# EAGLE design Qwiic_Haptic_Driver_DA7280 (EAGLE 9.6.2)
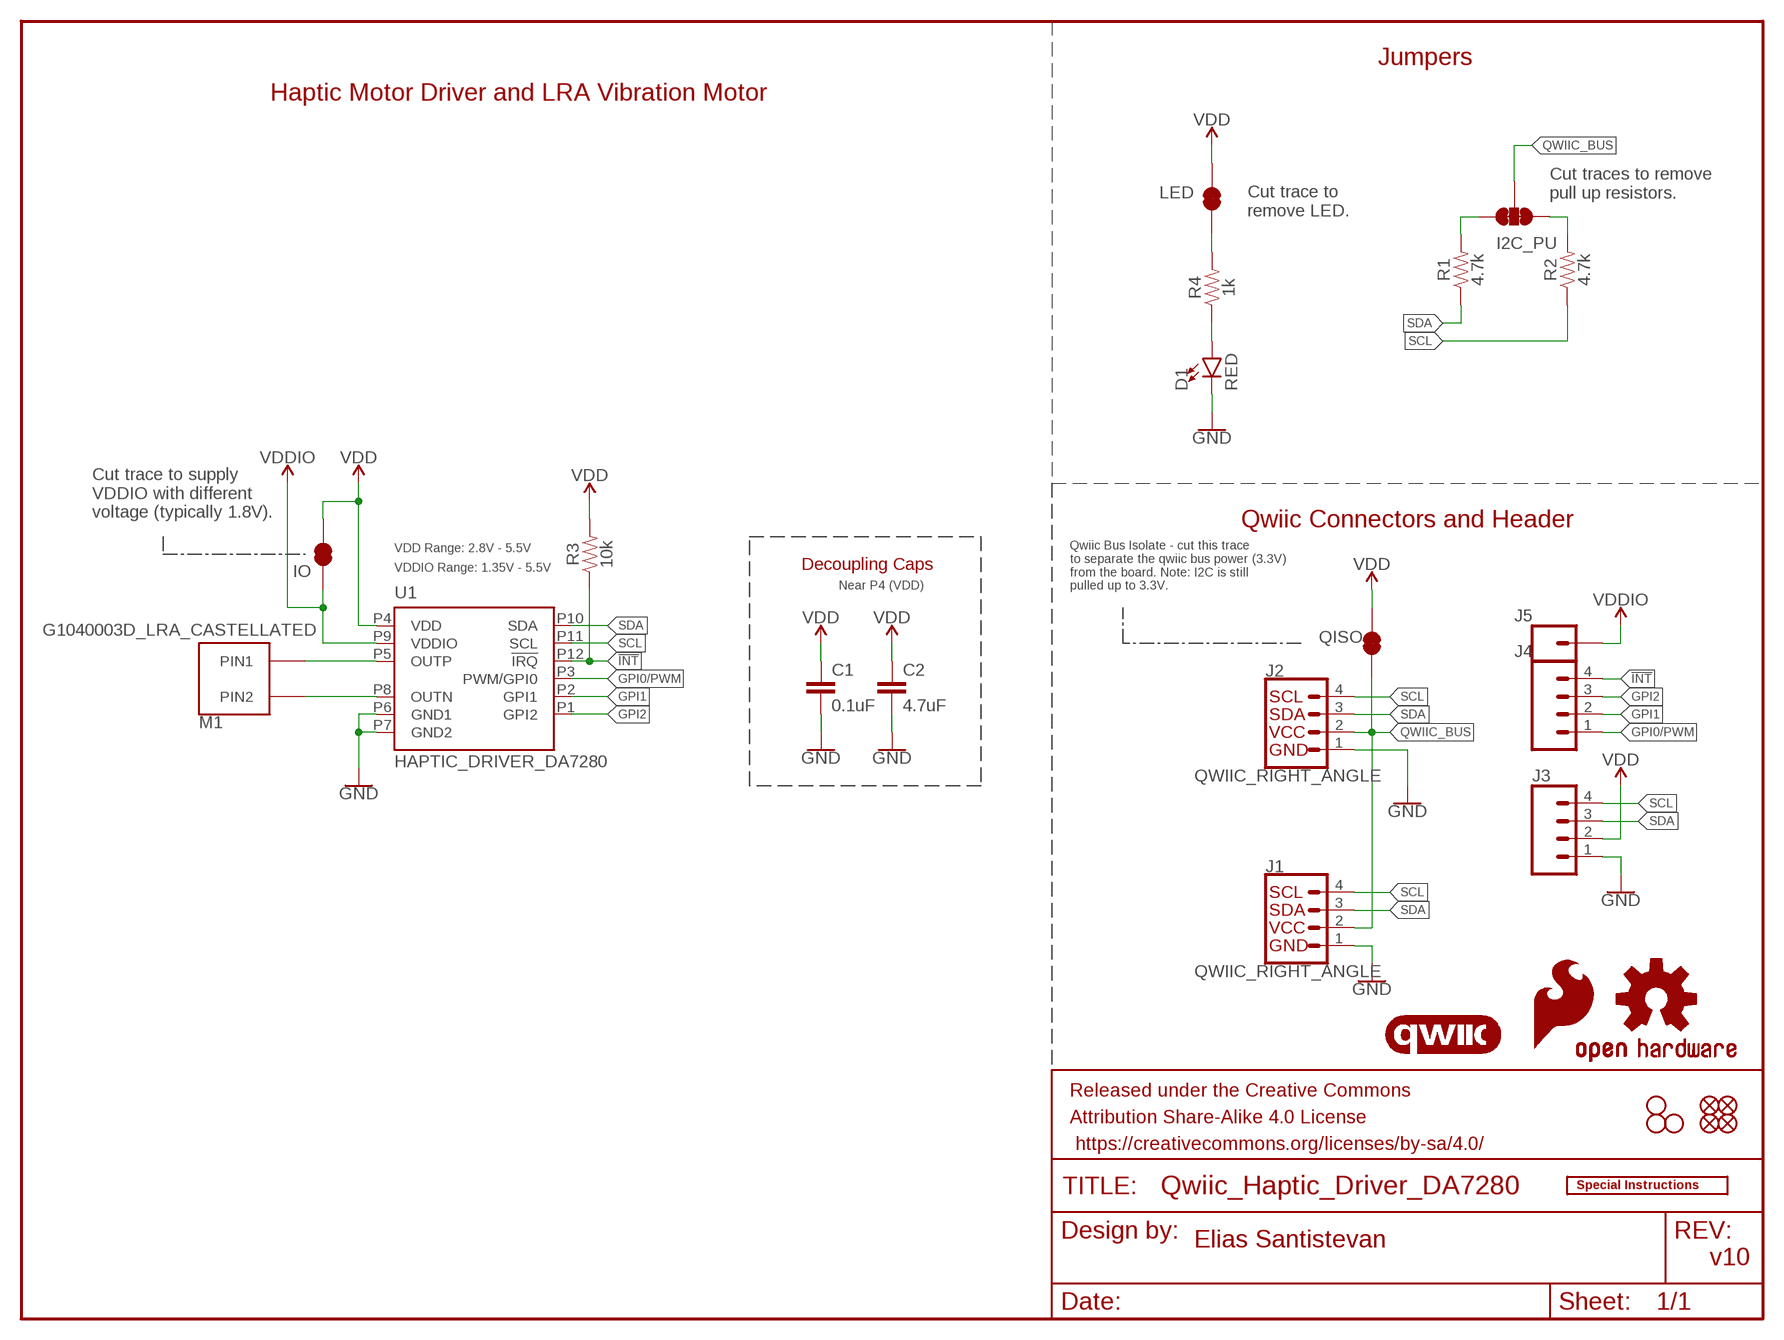
[diagram p0: schematic, sheet 1]

## Parts
C1  0.1uF  0.1UF-0603-25V-5%  [0603]
C2  4.7uF  4.7UF-0603-6.3V-(10%)  [0603]
D1  RED  LED-RED0603  [LED-0603]
FD1  FIDUCIALUFIDUCIAL  [FIDUCIAL-MICRO]
FD2  FIDUCIALUFIDUCIAL  [FIDUCIAL-MICRO]
FD3  FIDUCIALUFIDUCIAL  [FIDUCIAL-MICRO]
FD4  FIDUCIALUFIDUCIAL  [FIDUCIAL-MICRO]
FRAME1  FRAME-LETTER  [CREATIVE_COMMONS]
H1  STAND-OFFTIGHT  [STAND-OFF-TIGHT]
H2  STAND-OFFTIGHT  [STAND-OFF-TIGHT]
H4  STAND-OFFTIGHT  [STAND-OFF-TIGHT]
J1  QWIIC_RIGHT_ANGLE  QWIIC_CONNECTORJS-1MM  [JST04_1MM_RA]
J2  QWIIC_RIGHT_ANGLE  QWIIC_CONNECTORJS-1MM  [JST04_1MM_RA]
J3  CONN_041X04_NO_SILK_NO_POP  [1X04_NO_SILK]
J4  CONN_041X04_NO_SILK_NO_POP  [1X04_NO_SILK]
J5  CONN_01PTH_NO_SILK_YES_STOP  [1X01_NO_SILK]
JP1  LED  JUMPER-SMT_2_NC_TRACE_SILK  [SMT-JUMPER_2_NC_TRACE_SILK]
JP2  LED  JUMPER-SMT_2_NC_TRACE_SILK  [SMT-JUMPER_2_NC_TRACE_SILK]
JP3  I2C_PU  JUMPER-SMT_3_2-NC_TRACE_SILK  [SMT-JUMPER_3_2-NC_TRACE_SILK]
JP4  LED  JUMPER-SMT_2_NC_TRACE_SILK  [SMT-JUMPER_2_NC_TRACE_SILK]
LOGO1  SPECIAL_INSTRUCTIONS-ORDERING  [ORDERING_INSTRUCTIONS]
LOGO2  OSHW-LOGOS  [OSHW-LOGO-S]
LOGO4  SFE_LOGO_FLAME.1_INCH  [SFE_LOGO_FLAME_.1]
M1  G1040003D_LRA_CASTELLATED  [COIN_VIBRATION_MOTOR_CASTEL]
R1  4.7k  4.7KOHM-0603-1/10W-1%  [0603]
R2  4.7k  4.7KOHM-0603-1/10W-1%  [0603]
R3  10k  10KOHM-0603-1/10W-1%  [0603]
R4  1k  1KOHM-0603-1/10W-1%  [0603]
U1  HAPTIC_DRIVER_DA7280  [QFN_DA7280]
U$1  QWIIC_LOGO_3MM  [QWIIC_3MM]

## Nets
!INT!: J4.4 R3.1 U1.P12(!IRQ!)
GND: C1.2 C2.2 D1.C J1.1 J2.1 J3.1 U1.P6(GND1) U1.P7(GND2)
GPI0/PWM: J4.1 U1.P3(PWM/GPI0)
GPI1: J4.2 U1.P2(GPI1)
GPI2: J4.3 U1.P1(GPI2)
N$1: D1.A R4.1
N$2: JP1.1 R4.2
N$3: JP3.3 R1.2
N$4: JP3.1 R2.2
N$5: M1.P$1(PIN1) U1.P5(OUTP)
N$6: M1.P$2(PIN2) U1.P8(OUTN)
QWIIC_BUS: J1.2 J2.2 JP3.2 JP4.1
SCL: J1.4 J2.4 J3.4 R2.1 U1.P11(SCL)
SDA: J1.3 J2.3 J3.3 R1.1 U1.P10(SDA)
VDD: C1.1 C2.1 J3.2 JP1.2 JP2.2 JP4.2 R3.2 U1.P4(VDD)
VDDIO: J5.1 JP2.1 U1.P9(VDDIO)

## Notes on the sheet
- Jumpers
- Haptic Motor Driver and LRA Vibration Motor
- Cut traces to remove 
  pull up resistors.
- Cut trace to 
  remove LED.
- Qwiic Connectors and Header
- Cut trace to supply 
  VDDIO with different 
  voltage (typically 1.8V).
- VDD Range: 2.8V - 5.5V
- VDDIO Range: 1.35V - 5.5V | Decoupling Caps
- IO
- Near P4 (VDD)
- Qwiic Bus Isolate - cut this trace
  to separate the qwiic bus power (3.3V)
  from the board. Note: I2C is still
  pulled up to 3.3V.
- QISO
- Elias Santistevan
- v10

## Library data of the parts
C1 = SparkFun-Capacitors:0.1UF: 0.1µF ceramic capacitors A capacitor is a passive two-terminal electrical component used to store electrical energy temporarily in an electric field.; PROD_ID: CAP-08604
C2 = SparkFun-Capacitors:4.7UF: 4.7µF ceramic capacitors A capacitor is a passive two-terminal electrical component used to store electrical energy temporarily in an electric field.; PROD_ID: CAP-08280
D1 = SparkFun-LED:LED-RED: Red SMD LED Used in manufacturing of most products at SparkFun Packages: 0603 - SMD 0603 package [Product Link] <http://docs.avagotech.com/docs/AV02-0551EN> 0603 SMART - SMD 0603 SMART package ( more efficient and expensive)[Product Link] <http://www.osram-os.com/Graphics/XPic2/00077099_0.pdf> 1206 - SMD1206 package [Product Link] <https://www.sparkfun.com/datasheets/DevTools/LilyPad/Q150OVS4.pdff> SparkFun Products: Pro Mini 328 -5V <https://www.sparkfun.com/products/821> RedBoard <https://www.sparkfun.com/products/12757> IOIO-OTG <https://www.sparkfun.com/products/13613>; PROD_ID: DIO-00819
FD1-FD4 = SparkFun-Aesthetics:FIDUCIAL: Fiducial Alignment Points Point-of-reference for pick-and-place machines and other optical instruments.
FRAME1 = SparkFun-Aesthetics:FRAME-LETTER: Schematic Frame - Letter Standard 8.5x11 US Letter frame
H1 H2 H4 = SparkFun-Hardware:STAND-OFF: Stand Off Drill holes for mechanically mounting via screws, standoffs, etc. Note: Use the keepout ring to avoid running the screw head into surrounding components. Variant Overviews STAND-OFF - Mechanical footprint for a #4 phillips button head screw. STAND-OFF-TIGHT - Mechanical footprint for a #4 phillips button head screw, Example SparkFun Products Screw - Phillips Head (1/4", 4-40, 10 pack) <https://www.sparkfun.com/products/10453> (PRT-10453) Screw - Phillips Head (1/2", 4-40, 10 pack) <https://www.sparkfun.com/products/10452> (PRT-10452) Screw - Phillips Head (3/4", 4-40, 10 pack) <https://www.sparkfun.com/products/10451> (PRT-10451) Screw - Phillips Head (1", 4-40, 10 pack) <https://www.sparkfun.com/products/10450> (PRT-10450)
J1 J2 = SparkFun-Connectors:QWIIC_CONNECTOR: SparkFun I2C Standard Qwiic Connector An SMD 1mm pitch JST connector makes it easy and quick (get it? Qwiic?) to connect I2C devices to each other. The Qwiic system <http://www.sparkfun.com/qwiic> enables fast and solderless connection between popular platforms and various sensors and actuators. We carry 200mm <https://www.sparkfun.com/products/14204>, 100mm <https://www.sparkfun.com/products/14205>, 50mm <https://www.sparkfun.com/products/14206>, and breadboard friendly <https://www.sparkfun.com/products/14207> Qwiic cables. We also offer 10 pcs strips <https://www.sparkfun.com/products/14323> the SMD connectors.; PROD_ID: CONN-13694
J3 J4 = SparkFun-Connectors:CONN_04: Multi connection point. Often used as Generic Header-pin footprint for 0.1 inch spaced/style header connections On any of the 0.1 inch spaced packages, you can populate with these: Break Away Headers - Straight <https://www.sparkfun.com/products/116> (PRT-00116) Break Away Male Headers - Right Angle <https://www.sparkfun.com/products/553> (PRT-00553) Female Headers <https://www.sparkfun.com/products/115> (PRT-00115) Break Away Headers - Machine Pin <https://www.sparkfun.com/products/117> (PRT-00117) Break Away Female Headers - Swiss Machine Pin <https://www.sparkfun.com/products/743> (PRT-00743) For SCREWTERMINALS and SPRING TERMINALS visit here: Screw Terimnals on SparkFun.com <https://www.sparkfun.com/search/results?term=Screw+Terminals> (5mm/3.5mm/2.54mm spacing) This device is also useful as a general connection point to wire up your design to another part of your project. Our various solder wires solder well into these plated through hole pads. Hook-Up Wire - Assortment (Stranded, 22 AWG) <https://www.sparkfun.com/products/11375> (PRT-11375) Hook-Up Wire - Assortment (Solid Core, 22 AWG) <https://www.sparkfun.com/products/11367> (PRT-11367) View the entire wire category on our website here <https://www.sparkfun.com/categories/141> Special notes: Molex polarized connector foot print use with SKU : PRT-08231 with associated crimp pins and housings. 1MM SMD Version SKU: PRT-10208
J5 = SparkFun-Connectors:CONN_01: Single connection point. Often used as Generic Header-pin footprint for 0.1 inch spaced/style header connections On any of the 0.1 inch spaced packages, you can populate with these: Break Away Headers - Straight <https://www.sparkfun.com/products/116> (PRT-00116) Break Away Male Headers - Right Angle <https://www.sparkfun.com/products/553> (PRT-00553) Female Headers <https://www.sparkfun.com/products/115> (PRT-00115) Break Away Headers - Machine Pin <https://www.sparkfun.com/products/117> (PRT-00117) Break Away Female Headers - Swiss Machine Pin <https://www.sparkfun.com/products/743> (PRT-00743) This device is also useful as a general connection point to wire up your design to another part of your project. Our various solder wires solder well into these plated through hole pads. Hook-Up Wire - Assortment (Stranded, 22 AWG) <https://www.sparkfun.com/products/11375> (PRT-11375) Hook-Up Wire - Assortment (Solid Core, 22 AWG) <https://www.sparkfun.com/products/11367> (PRT-11367) View the entire wire category on our website here <https://www.sparkfun.com/categories/141> Special notes: SMTSO-256-ET is a "flush mount" nut for a 4-40 screw. We mostly use this on specialty testbeds; it is a nice way to connect hardware to your PCB at an adjustable hieght. Also note, the SNAP packages are for using a snappable style connector. We sell a baggie of snaps and they are also used on two LilyPad designs: Snap Assortment - 30 pack (male and female) <https://www.sparkfun.com/products/11347> (DEV-11347) LilyPad Arduino SimpleSnap <https://www.sparkfun.com/products/10941> (DEV-10941) LilyPad SimpleSnap Protoboard <https://www.sparkfun.com/products/10940> (DEV-10940)
JP1 JP2 JP4 = SparkFun-Jumpers:JUMPER-SMT_2_NC_TRACE: Normally closed trace jumper This jumper has a trace between two pads so it's normally closed (NC). Use a razor knife to open the connection. For best results follow the IPC guidelines for cutting traces: Cutout at least 0.063 mm (0.005 in). Remove all loose material to clean up the cut area. Seal the cut with an approved epoxy. Reapply solder to reclose the connection.
JP3 = SparkFun-Jumpers:JUMPER-SMT_3_2-NC_TRACE: Normally closed trace jumper (2 of 2 connections) This jumper has a trace between all three pads so they are normally closed (NC). Use a razor knife to open the connection(s). For best results follow the IPC guidelines for cutting traces: Cutout at least 0.063 mm (0.005 in). Remove all loose material to clean up the cut area. Seal the cut with an approved epoxy. Reapply solder to reclose the connection(s).
LOGO1 = SparkFun-Aesthetics:SPECIAL_INSTRUCTIONS: Special Ordering/Production Instructions Alert Symbol for special PCB ordering instructions or unique production process warnings. Ordering Instructions Production Instructions Types of information that should be added to box: Copper weight Soldermask color Silk color PCB thickness Number of layers PCB Standard: 1.6mm FR4 1 oz copper immersion silver plating red soldermask white silkscreen Types of information that should be added to box: Special wash requirements Depaneling instructions Humidification Glue curing Default text settings: 0.07 inch 9% ratio 50% line distance
LOGO2 = SparkFun-Aesthetics:OSHW-LOGO: Open-Source Hardware (OSHW) Logo This logo indicates the piece of hardware it is found on incorporates a OSHW license and/or adheres to the definition of open source hardware found here: http://freedomdefined.org/OSHW
LOGO4 = SparkFun-Aesthetics:SFE_LOGO_FLAME: SparkFun Flame Logo This is the SparkFun flame logo. The logo on the schematic will always be the same size; the package variant is the height of the flame. Default layer for the logo on the board is tSilk.
M1 = TEMP:G1040003D_LRA: G1040003D Coin Vibration Motor - Jinlong Machinery and Electronics Inc. LRA Coin Vibration Motor SparkFun Products: [PRODUCT 1] <[PRODUCT1LINK]>; PROD_ID: COMP-15536
R1 R2 = SparkFun-Resistors:4.7KOHM: 4.7kΩ resistor A resistor is a passive two-terminal electrical component that implements electrical resistance as a circuit element. Resistors act to reduce current flow, and, at the same time, act to lower voltage levels within circuits. - Wikipedia; PROD_ID: RES-07857
R3 = SparkFun-Resistors:10KOHM: 10kΩ resistor A resistor is a passive two-terminal electrical component that implements electrical resistance as a circuit element. Resistors act to reduce current flow, and, at the same time, act to lower voltage levels within circuits. - Wikipedia; PROD_ID: RES-00824
R4 = SparkFun-Resistors:1KOHM: 1kΩ resistor A resistor is a passive two-terminal electrical component that implements electrical resistance as a circuit element. Resistors act to reduce current flow, and, at the same time, act to lower voltage levels within circuits. - Wikipedia; PROD_ID: RES-07856
U1 = TEMP:HAPTIC_DRIVER_DA7280: DA7280 Haptic Driver DA7280 is a linear resonant actuator (LRA) and eccentric rotating mass (ERM) haptic driver offering automatic closed-loop LRA resonant frequency tracking.; PROD_ID: IC-15534
U$1 = SparkFun-Aesthetics:QWIIC_LOGO: Qwiic Logos for placement on schematic and PCB. The 5.5mm silk logo is best for placing next to Qwiic connector.

## Board
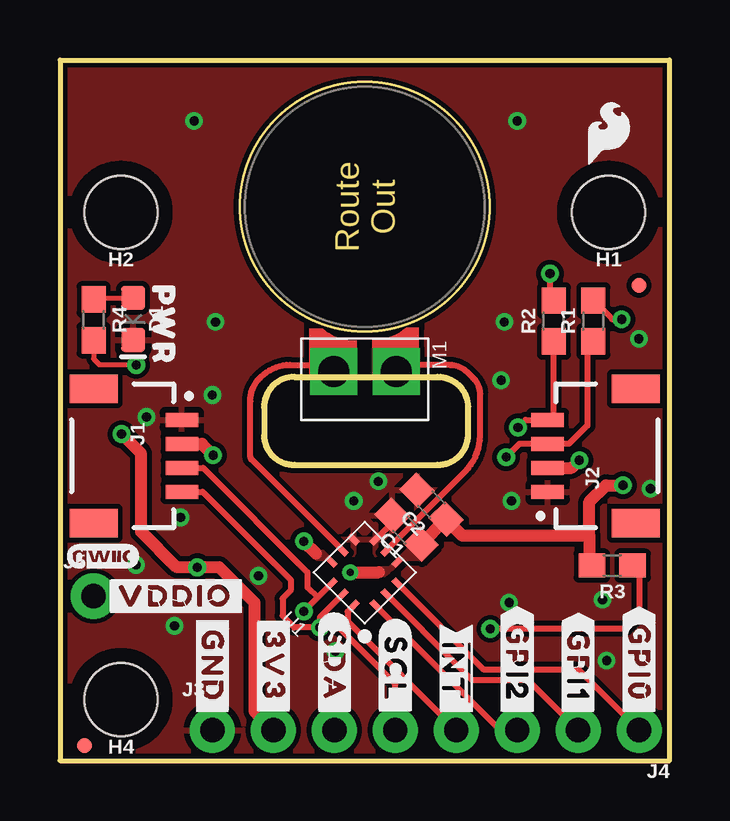
[diagram p1: board, top side]
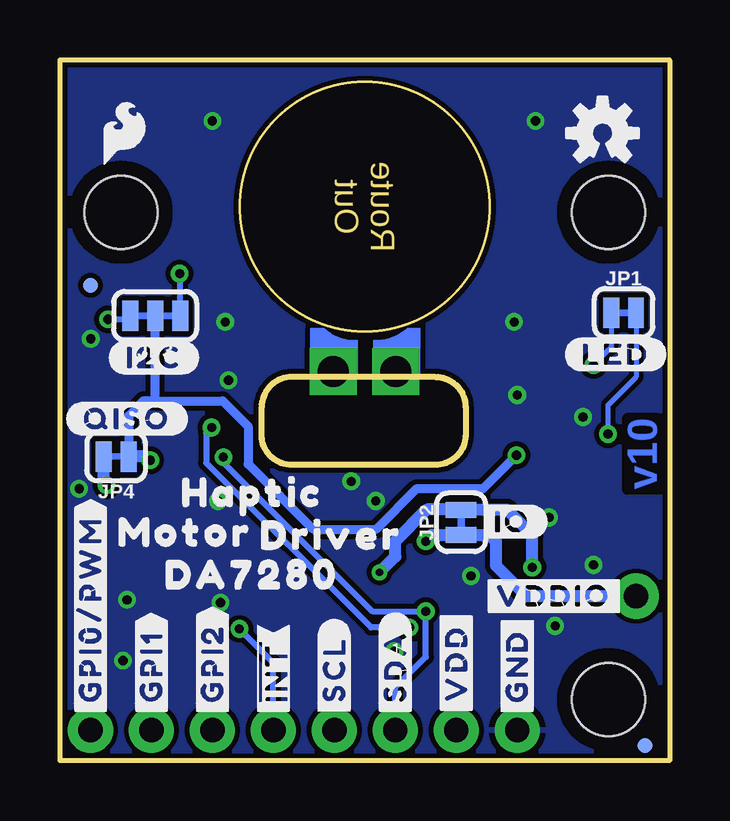
[diagram p2: board, bottom side, seen from below]

Size 25.4 x 29.21 mm. Coordinates in mm from the lower left corner, seen from the top.
Outline: 0,29.21 0,0 25.4,0 25.4,29.21 0,29.21
Outline: 9.77,16 15.73,16 arc-90 17,14.73 17,13.55 arc-90 15.73,12.33 9.77,12.33 arc-90 8.5,13.55 8.5,14.73 arc-90 9.77,16
Copper layers (1*16): Top 0.035mm / dielectric 1.5mm / Bottom 0.035mm
Design rules "SparkFun-2-layer-TIGHT": minimum track width 7mil, minimum drill 15mil, track to track 7mil, track to pad 7mil, pad to pad 7mil, via to via 7mil, smd to smd 7mil, copper to edge 7mil, drill to drill 7mil, minimum pad ring 7mil, minimum via ring 7mil, stop-mask expansion 4mil, vias tented up to drill 25mil, thermal gap 10mil
tRestrict: area 12.5,8.3 to 12.9,8.5; area 15.5,11.8 to 15.7,12

### Footprints (pad centres in the part's own frame; a part is rotated, then mirrored left to right if it is on the bottom)
0603 = smd 1.1 x 1: 1 -0.85,0; 2 0.85,0
LED-0603 = smd 1 x 1: A -0.877,0; C 0.877,0
FIDUCIAL-MICRO = smd 0.635 x 0.635: 1 0,0
STAND-OFF-TIGHT = hole 3.048: 0,0
JST04_1MM_RA = smd 0.6 x 1.35: 1 -1.5,0; 2 -0.5,0; 3 0.5,0; 4 1.5,0 | smd 1.2 x 2: NC1 2.8,-3.675; NC2 -2.8,-3.675
1X04_NO_SILK = drill 1.016 pad 1.88: 1 0,0; 2 2.54,0; 3 5.08,0; 4 7.62,0
1X01_NO_SILK = drill 1.016 pad 1.88: 1 0,0
SMT-JUMPER_2_NC_TRACE_SILK = smd 0.66 x 1.27: 1 -0.521,0; 2 0.521,0
SMT-JUMPER_3_2-NC_TRACE_SILK = smd 0.66 x 1.27: 1 -1.041,0; 2 0,0; 3 1.041,0
COIN_VIBRATION_MOTOR_CASTEL = drill 1.3 square: P$1 6.87,1.31; P$2 6.87,-1.29
QFN_DA7280 = smd 0.5 x 0.25: P1 -1.32,0.68; P2 -1.32,0.03; P3 -1.32,-0.62; P7 1.28,-0.62; P8 1.28,0.03; P9 1.28,0.68 | smd 0.25 x 0.5: P4 -0.67,-1.27; P5 -0.02,-1.27; P6 0.63,-1.27; P10 0.63,1.33; P11 -0.02,1.33; P12 -0.67,1.33

### Placement (x,y rotation side)
C1  14.45,9.62 135 top
C2  15.48,10.67 135 top
D1  3.05,18.41 270 top
FD1  1.02,0.64 180 top
FD2  1.02,0.64 180 bottom
FD3  24.13,19.81 180 top
FD4  24.13,19.81 180 bottom
FRAME1  -13.97,-12.7 0 top  (outside the outline)
H1  22.86,22.86 180 top
H2  2.54,22.86 180 top
H4  2.54,2.54 180 top
J1  5.08,12.7 270 top
J2  20.32,12.7 90 top
J3  6.35,1.27 0 top
J4  24.13,1.27 180 top
J5  1.4,6.86 0 top
JP1  1.92,18.67 0 bottom
JP2  8.69,9.94 90 bottom
JP3  21.44,18.54 180 bottom
JP4  23.06,12.67 180 bottom
LOGO1  30.48,50.8 0 top  (outside the outline)
LOGO2  2.79,26.16 0 bottom
LOGO4  22.86,26.16 0 top
M1  12.7,23.09 270 top
R1  22.23,18.33 90 top
R2  20.57,18.33 90 top
R3  23.01,8.13 180 top
R4  1.4,18.38 270 top
U1  12.7,7.87 135 top
U$1  1.79,8.51 0 top
U$2  [#3V3#1]  8.89,3.94 270 top
U$3  [#GND#0]  6.35,3.94 270 top
U$4  [#GPI0#6]  24.13,4.06 270 top
U$5  [#GPI1#6]  21.59,3.94 270 top
U$6  [#GPI2#6]  19.05,4.06 270 top
U$7  [#VDD#4]  8.89,4.06 90 bottom
U$8  [#SDA#4]  11.43,3.94 270 top
U$9  [HAPTIC6]  17.4,11.18 0 bottom
U$10  [MOTOR7]  20.19,9.53 0 bottom
U$11  [DRIVER8]  14.1,9.4 0 bottom
U$12  [#GPI0#PWM#2]  24.13,6.3 90 bottom
U$13  [#GPI1#2]  21.59,3.94 90 bottom
U$14  [#GPI2#2]  19.05,4.06 90 bottom
U$15  [#VDDIO#5]  4.83,6.86 0 top
U$16  [#SDA#0]  11.43,3.94 90 bottom
U$18  [#GND#0]  6.35,3.94 90 bottom
U$19  [#SCL#5]  13.97,3.81 270 top
U$20  [PWR72810]  4.32,18.16 270 top
U$21  [#SCL#1]  13.97,3.81 90 bottom
U$23  [#I2C#4]  21.49,16.8 0 bottom
U$24  [#LED#4]  2.25,16.93 0 bottom
U$25  [#VDDIO#5]  4.83,6.86 0 bottom
U$26  [SFE_LOGO_FLAME_.1]  22.73,26.16 0 bottom
U$27  [##INT##3]  16.51,3.68 90 bottom
U$28  [##INT##6]  16.51,3.68 270 top
U$29  [DA72809]  17.4,7.75 0 bottom
U$30  [#IO#6]  6.55,9.96 0 bottom
U$31  [#QISO#0]  22.61,14.25 0 bottom

### Tracks (layer width: path | path; a pad name or v marks a point on that pad's centre or on a via)
!INT!  (via drill 0.38)
  Top 0.254: R3.1 24.13,7.86 24.13,6.1 23.53,5.49 v17.93,5.49 | J4.4 11.98,5.8 11.98,6.21 U1.P12
  Bottom 0.254: v17.93,5.49 16.51,4.08 J4.4
GND  (via drill 0.38)
  Top 0.254: C1.2 13.84,9.91 U1.P6
  other vias: 12.24,10.82 18.81,10.83 18.71,6.58 22.78,4.17 13.27,11.64 3.61,14.33 18.38,15.86 24.12,17.58 11.47,4.55 6.48,18.29 5.59,26.67 6.35,15.24 18.52,18.29 19.05,26.67 4.77,5.62 3.17,8.16 22.61,6.71 8.27,7.7 5.02,10.14 24.6,11.34
  pour Top (isolate 0.203, rank 4): 25.4,0 0,0 0,29.21 25.4,29.21
  pour Bottom (isolate 0.203, rank 4): 25.4,0 0,0 0,29.21 25.4,29.21
GPI0/PWM
  Top 0.254: J4.1 21.61,3.79 17.67,3.79 U1.P3
GPI1
  Top 0.254: J4.2 19.51,3.35 17.18,3.35 16.62,3.92 U1.P2
GPI2
  Top 0.254: U1.P1 18.34,1.27 J4.3
N$1
  Top 0.203: R4.1 1.46,19.29 D1.A
N$2  (via drill 0.38)
  Top 0.203: v3.17,16.49 1.65,16.49 1.4,16.75 R4.2
  Bottom 0.203: JP1.1 2.44,17.27 2.44,17.23 2.59,17.07 v3.17,16.49
N$3  (via drill 0.38)
  Top 0.254: R1.2 23,18.4 v23.4,18.4
  Bottom 0.254: v23.4,18.4 22.62,18.4 JP3.3
N$4  (via drill 0.38)
  Top 0.254: v20.42,20.3 20.42,19.34 R2.2
  Bottom 0.254: v20.42,20.3 20.4,20.29 JP3.1
N$5
  Top 0.254: M1.P$1 14.29,16.5 16.24,16.5 arc-45 16.96,16.2 17.22,15.95 arc-45 17.5,15.26 17.5,13.72 17.5,13.53 arc-45 16.89,12.06 13.61,8.78 U1.P5
N$6
  Top 0.254: M1.P$2 11.13,16.5 9.58,16.5 arc45 8.38,16 8.33,15.95 arc45 7.93,14.99 7.93,12.67 arc45 7.98,12.55 U1.P8
QWIIC_BUS  (via drill 0.38)
  Top 0.508: J2.2 21.32,12.2 v21.64,12.52 | J1.2 5.91,13.2 v6.38,12.73
  Bottom 0.381: JP4.1 22.54,14.38 21.93,14.99 21.44,14.99 | 21.44,14.99 JP3.2 | 21.44,14.99 18.63,14.99 17.56,13.93 17.56,12.36 14.85,9.64 12.23,9.64 10.53,11.35 7.77,11.35 v6.38,12.73
  Bottom 0.508: v21.64,12.52 21.79,12.68 JP4.1
SCL  (via drill 0.38)
  Top 0.254: J1.4 5.95,11.2 9.63,7.51 9.63,7.12 9.27,6.76 9.27,6.03 9.75,5.55 v10.83,5.55 | R2.1 20.57,14.45 J2.4 19.39,14.2 v19.08,13.89 | v10.83,5.55 10.83,5.98 U1.P11 | J3.4 13.97,3.2 11.62,5.55 v10.83,5.55
  Bottom 0.254: v10.83,5.55 12.44,5.55 19.31,12.42 19.31,13.66 v19.08,13.89
SDA  (via drill 0.38)
  Top 0.254: v18.59,12.65 19.14,13.2 J2.3 21.2,13.2 21.97,13.97 21.97,17.22 R1.1 | J1.3 5.96,12.2 10.31,7.85 10.31,7.22 10.73,6.79 | v10.16,6.22 10.73,6.79 | 10.73,6.79 U1.P10
  Bottom 0.254: v18.59,12.65 18.59,12.43 12.39,6.22 v10.16,6.22 10.16,4.32 11.43,3.05 J3.3
VDD  (via drill 0.3, 0.38)
  Top 0.381: 15.11,9.02 C1.1 | 16.08,10.05 C2.1
  Top 0.508: 22.06,9.38 22.06,8.23 R3.2 | C2.1 16.76,9.38 22.06,9.38 | C1.1 16.08,10.05 | v12.09,7.85 13.28,7.85 | 22.06,9.38 22.06,10.79 22.74,11.48 v23.46,11.48 | J3.2 8.1,2.06 8.1,6.59 6.63,8.06 v5.72,8.06 4.87,8.06 3.38,9.55 3.38,12.8 v2.56,13.61
  Bottom 0.203: JP1.2 1.4,15.99 2.56,14.83 v2.56,13.61
  Bottom 0.508: v12.09,7.85 11.43,8.51 11.43,9.14 10.11,10.46 JP2.2 6.77,10.46 5.72,9.4 v5.72,8.06 | v23.46,11.48 23.58,11.61 JP4.2
  pour Top (isolate 0.305, no thermals): 13.72,8.05 14.5,8.84 14.5,8.97 15.09,9.55 15.67,8.97 15.06,8.36 14.25,8.36 13.59,7.7 13.21,7.7 13.21,8.05
VDDIO  (via drill 0.38)
  Top 0.508: v10.16,9.14 10.67,8.64
  Bottom 0.508: J5.1 5.96,6.86 7.24,8.13 7.24,9.14 7.51,9.41 JP2.1 9.89,9.41 v10.16,9.14
  pour Top (isolate 0.305, no thermals): 11.51,8.2 11,8.71 10.57,8.71 10.46,8.61 10.69,8.38 11.18,8.38 11.43,8.13

### Text on the board
Bottom: v10
tDocu: Castellated Leads | Elias Santistevan